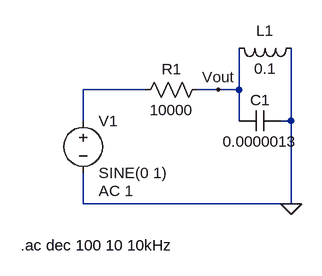
[diagram p0: schematic PassaBanda440Hz.asc]
PassaBanda440Hz.asc, the LTspice schematic file:
Version 4.1
SHEET 1 880 680
WIRE 64 80 -32 80
WIRE 176 80 144 80
WIRE 208 80 208 16
WIRE 208 80 176 80
WIRE -32 128 -32 80
WIRE 208 128 208 80
WIRE 288 128 288 16
WIRE 288 128 272 128
WIRE -32 256 -32 208
WIRE 288 256 288 128
WIRE 288 256 -32 256
FLAG 288 256 0
FLAG 176 80 Vout
SYMBOL voltage -32 112 R0
WINDOW 123 24 124 Left 2
WINDOW 39 0 0 Left 0
SYMATTR Value2 AC 1
SYMATTR InstName V1
SYMATTR Value SINE(0 1)
SYMBOL res 160 64 R90
WINDOW 0 0 56 VBottom 2
WINDOW 3 32 56 VTop 2
SYMATTR InstName R1
SYMATTR Value 10000
SYMBOL ind 304 0 R90
WINDOW 0 5 56 VBottom 2
WINDOW 3 32 56 VTop 2
SYMATTR InstName L1
SYMATTR Value 0.1
SYMATTR SpiceLine Rser=1m
SYMBOL cap 272 112 R90
WINDOW 0 0 32 VBottom 2
WINDOW 3 32 32 VTop 2
SYMATTR InstName C1
SYMATTR Value 0.0000013
TEXT -128 320 Left 2 !.ac dec 100 10 10kHz

The netlist it stands for:
* PassaBanda440Hz.asc
V1 N001 0 SINE(0 1) AC 1
R1 Vout N001 10000
L1 0 Vout 0.1 Rser=1m
C1 0 Vout 0.0000013
.ac dec 100 10 10kHz
.backanno
.end

* Results of the author's LTspice run, read from the files saved beside the schematic
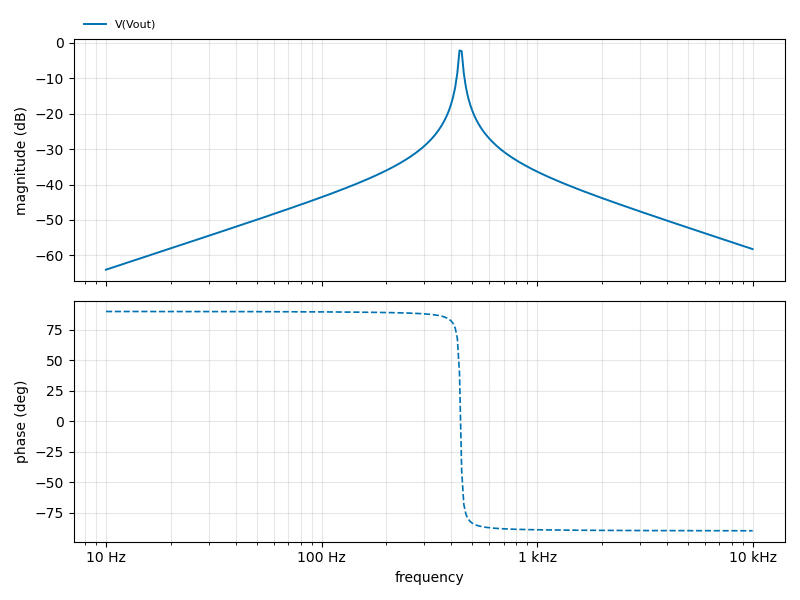
[diagram p1: AC Analysis of PassaBanda440Hz.asc, plotted from the saved traces]
* AC Analysis, 1 run:
*   V(Vout): -64.03 dB at 10 Hz, -58.23 dB at 10 kHz, peak -2.17 dB at 436.5 Hz, 3 dB below the peak at 431.8 Hz and 451.3 Hz